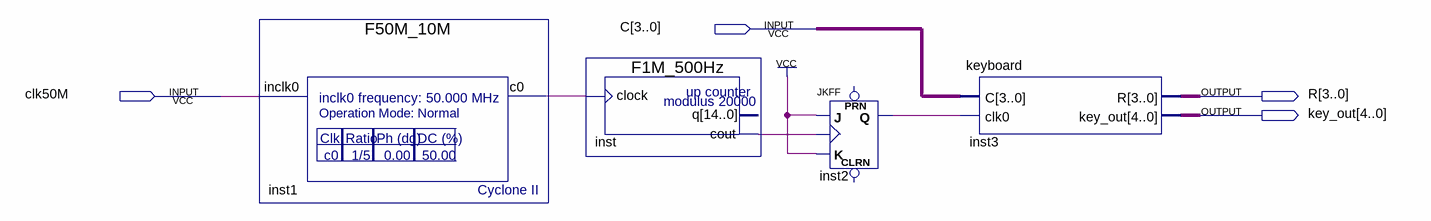
[diagram p0: schematic sheet]
// Quartus schematic keyboard_top.bdf as structural Verilog: 4 symbols, 4 pins
module keyboard_top (
  input  [3:0] C,
  input  clk50M,
  output [3:0] R,
  output [4:0] key_out
);

  wire inst1_c0, inst2_q, inst_cout;

  F50M_10M inst1 (.inclk0(clk50M), .c0(inst1_c0));
  F1M_500Hz inst (.clock(inst1_c0), .cout(inst_cout));  // open: q
  JKFF inst2 (.K(1'b1), .J(1'b1), .CLK(inst_cout), .Q(inst2_q));  // open: PRN, CLRN
  keyboard inst3 (.C(C), .clk0(inst2_q), .R(R), .key_out(key_out));
endmodule
